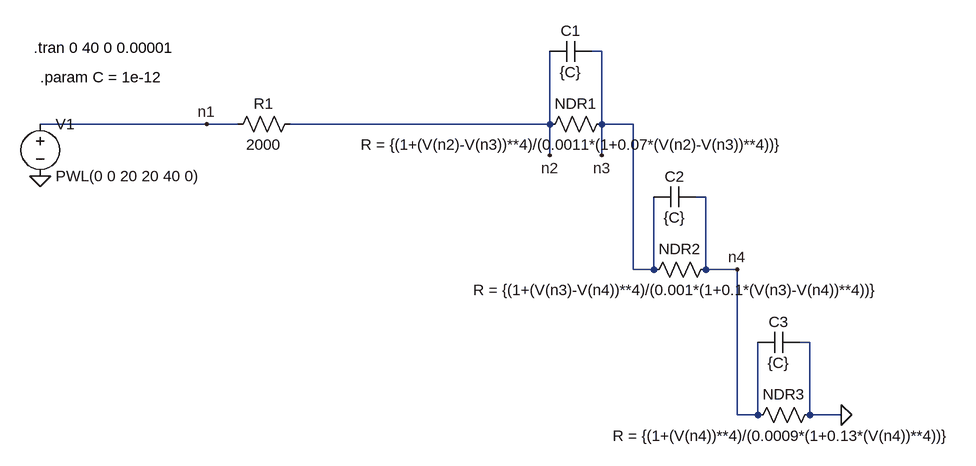
[diagram p0: schematic geo_construct_c.asc]
geo_construct_c.asc, the LTspice schematic file:
Version 4
SHEET 1 1052 680
WIRE 272 -224 256 -224
WIRE -336 -112 -592 -112
WIRE -288 -112 -336 -112
WIRE 192 -112 192 -224
WIRE 192 -112 -208 -112
WIRE 272 -112 272 -224
WIRE 320 -112 272 -112
WIRE 192 -64 192 -112
WIRE 272 -64 272 -112
WIRE 432 0 416 0
WIRE 320 112 320 -112
WIRE 352 112 352 0
WIRE 352 112 320 112
WIRE 432 112 432 0
WIRE 480 112 432 112
WIRE 592 224 576 224
WIRE 480 336 480 112
WIRE 512 336 512 224
WIRE 512 336 480 336
WIRE 592 336 592 224
WIRE 640 336 592 336
FLAG -592 -32 0
FLAG 192 -64 n2
FLAG 272 -64 n3
FLAG -336 -112 n1
FLAG 640 336 0
FLAG 480 112 n4
SYMBOL res 176 -96 R270
WINDOW 0 32 56 VTop 2
WINDOW 3 0 56 VBottom 2
SYMATTR InstName NDR1
SYMATTR Value R = {(1+(V(n2)-V(n3))**4)/(0.0011*(1+0.07*(V(n2)-V(n3))**4))}
SYMBOL res 336 128 R270
WINDOW 0 32 56 VTop 2
WINDOW 3 0 56 VBottom 2
SYMATTR InstName NDR2
SYMATTR Value R = {(1+(V(n3)-V(n4))**4)/(0.001*(1+0.1*(V(n3)-V(n4))**4))}
SYMBOL voltage -592 -128 R0
WINDOW 123 0 0 Left 0
WINDOW 39 0 0 Left 0
SYMATTR InstName V1
SYMATTR Value PWL(0 0 20 20 40 0)
SYMBOL res -304 -96 R270
WINDOW 0 32 56 VTop 2
WINDOW 3 0 56 VBottom 2
SYMATTR InstName R1
SYMATTR Value 2000
SYMBOL res 496 352 R270
WINDOW 0 32 56 VTop 2
WINDOW 3 0 56 VBottom 2
SYMATTR InstName NDR3
SYMATTR Value R = {(1+(V(n4))**4)/(0.0009*(1+0.13*(V(n4))**4))}
SYMBOL cap 256 -240 R90
WINDOW 0 0 32 VBottom 2
WINDOW 3 32 32 VTop 2
SYMATTR InstName C1
SYMATTR Value {C}
SYMBOL cap 416 -16 R90
WINDOW 0 0 32 VBottom 2
WINDOW 3 32 32 VTop 2
SYMATTR InstName C2
SYMATTR Value {C}
SYMBOL cap 576 208 R90
WINDOW 0 0 32 VBottom 2
WINDOW 3 32 32 VTop 2
SYMATTR InstName C3
SYMATTR Value {C}
TEXT -602 -230 Left 2 !.tran 0 40 0 0.00001
TEXT -592 -184 Left 2 !.param C = 1e-12

The netlist it stands for:
* geo_construct_c.asc
R§NDR1 n2 n3 R = {(1+(V(n2)-V(n3))**4)/(0.0011*(1+0.07*(V(n2)-V(n3))**4))}
R§NDR2 n3 n4 R = {(1+(V(n3)-V(n4))**4)/(0.001*(1+0.1*(V(n3)-V(n4))**4))}
V1 n1 0 PWL(0 0 20 20 40 0)
R1 n1 n2 2000
R§NDR3 n4 0 R = {(1+(V(n4))**4)/(0.0009*(1+0.13*(V(n4))**4))}
C1 n3 n2 {C}
C2 n4 n3 {C}
C3 0 n4 {C}
.tran 0 40 0 0.00001
.param C = 1e-12
.backanno
.end